# Altium schematic sheet 03-GPS.SchDoc
size A4
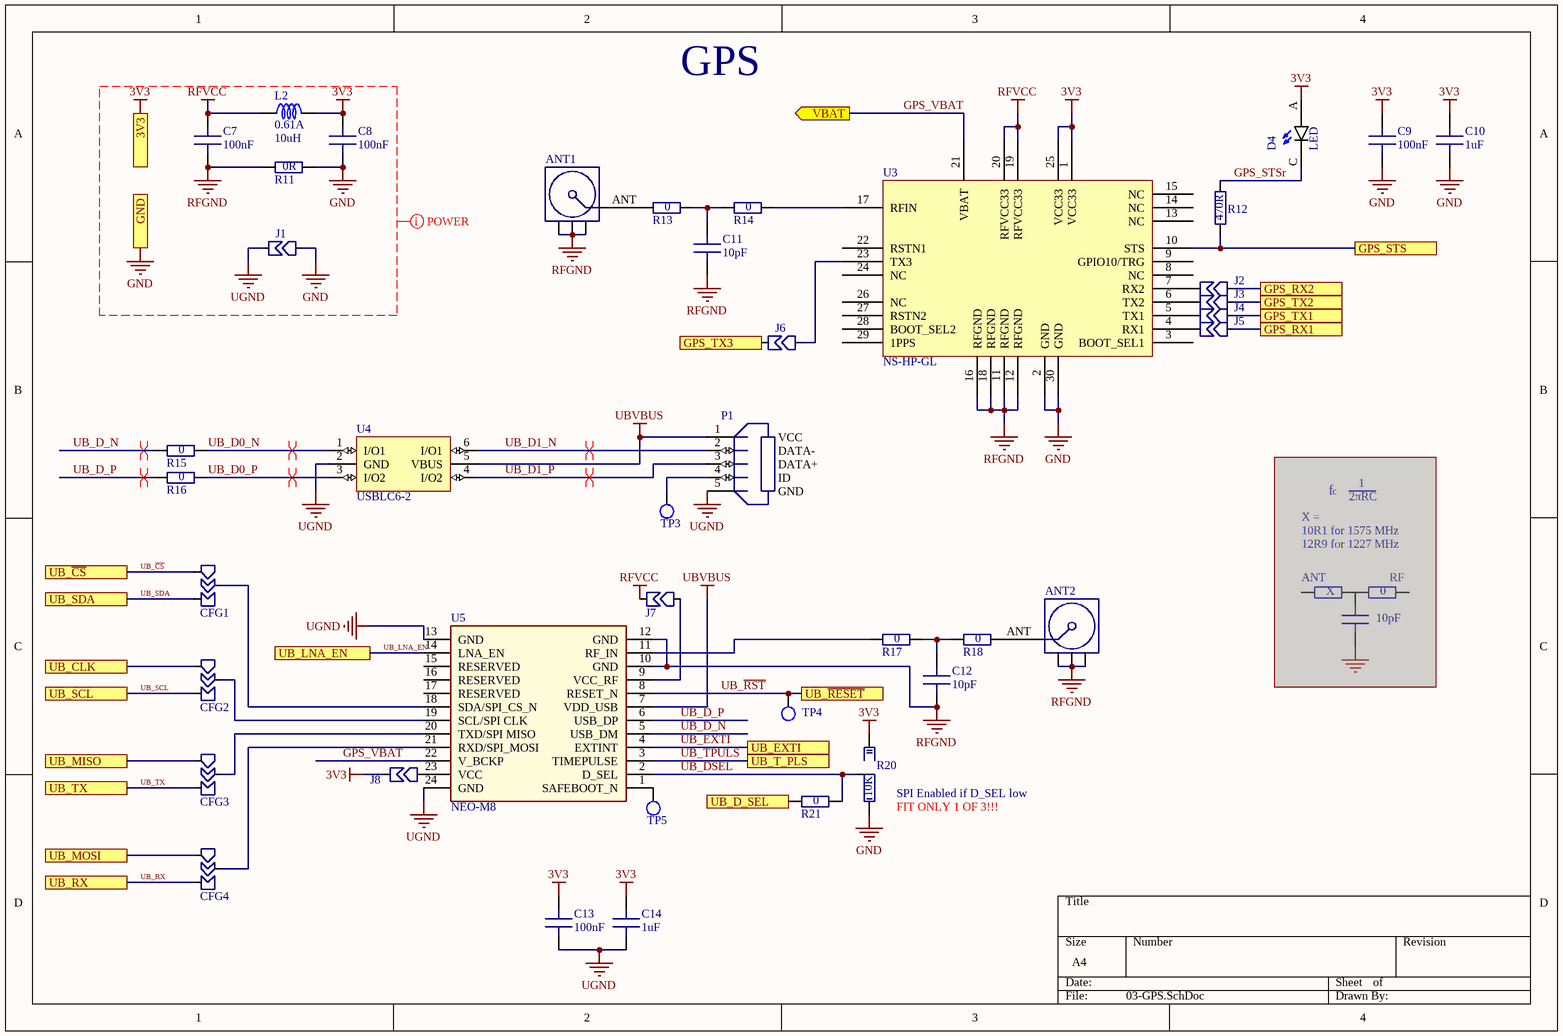
[diagram p0: 03-GPS.SchDoc]

## Parts
(Parts that share a designator on the sheet are numbered #1, #2 ... from top to bottom, then left to right.)
ANT1  UFL  [U.FL CONNECTOR]  (value not drawn)
ANT2  UFL  [U.FL CONNECTOR]  (value not drawn)
C7  100nF  [C0603_NOSILK]
C8  100nF  [C0603_NOSILK]
C9  100nF  [C0603]
C10  1uF  [C0805]
C11  10pF  [C0402]
C12  10pF  [C0402]
C13  100nF  [C0603]
C14  1uF  [C0805]
C_F  10pF  [C0402]  (masked out: inside a compile mask, not in the netlist)
CFG1  CFG3_ORTH  [CFG_0603]  (value not drawn)
CFG2  CFG3_ORTH  [CFG_0603]  (value not drawn)
CFG3  CFG3_ORTH  [CFG_0603]  (value not drawn)
CFG4  CFG3_ORTH  [CFG_0603]  (value not drawn)
D4  LED  [LED_0604]
J1  CFG2  [CFG_J_0603]  (value not drawn)
J2  CFG2  [CFG_J_0603]  (value not drawn)
J3  CFG2  [CFG_J_0603]  (value not drawn)
J4  CFG2  [CFG_J_0603]  (value not drawn)
J5  CFG2  [CFG_J_0603]  (value not drawn)
J6  CFG2  [CFG_J_0603]  (value not drawn)
J7  CFG2  [CFG_J_0603]  (value not drawn)
J8  CFG2  [CFG_J_0603]  (value not drawn)
L2  Current: 0.61A  Inductivity: 10uH  [L_CDRH4D18]  (hidden comment: *)
P1  440247-2  [CON-UUSB-F-2]  (value not drawn)
R11  Resistance: 0R  [R0805]
R12  Resistance: 470R  [R0603]
R13  Resistance: 0  [R0402]
R14  Resistance: 0  [R0402]
R15  Resistance: 0  [R0402]
R16  Resistance: 0  [R0402]
R17  Resistance: 0  [R0402]
R18  Resistance: 0  [R0402]
R20  Resistance: 10K  [RJ0603]
R21  Resistance: 0  [R0603]
R?#1  Resistance: X  [R0402]  (masked out: inside a compile mask, not in the netlist)
R?#2  Resistance: 0  [R0402]  (masked out: inside a compile mask, not in the netlist)
TP3  TEST_POINT  [TP_1mm]  (value not drawn)
TP4  TEST_POINT  [TP_1mm]  (value not drawn)
TP5  TEST_POINT  [TP_1mm]  (value not drawn)
U3  NS-HP-GL  [SKYTRAQ-MOD-COMB]
U4  USBLC6-2  [SOT-666]
U5  NEO-M8  [NEO]

## Ports
3V3 (out), GND, GPS_RX1, GPS_RX2, GPS_STS, GPS_TX1, GPS_TX2, GPS_TX3, UB_CLK, UB_D_SEL, UB_EXTI, UB_LNA_EN, UB_MISO, UB_MOSI, UB_RX, UB_SCL, UB_SDA, UB_T_PLS, UB_TX, UB_~{CS}, UB_~{RESET}, VBAT (out)

## Nets
3V3: C8.2 C9.2 C10.2 C13.2 C14.2 D4.A J8.1(A) L2.2 R20.3 U3.1(VCC33) U3.25(VCC33) ; port 3V3
GND: C8.1 C9.1 C10.1 J1.2(IN) R11.2 R20.1 U3.2(GND) U3.30(GND) ; port GND
RFGND: ANT1.GND ANT2.GND C7.1 C11.1 C12.1 R11.1 U3.11(RFGND) U3.12(RFGND) U3.16(RFGND) U3.18(RFGND) U5.10(GND) U5.12(GND)
RFVCC: C7.2 J7.1(A) L2.1 U3.19(RFVCC33) U3.20(RFVCC33)
UBVBUS: P1.1(VCC) U4.5(VBUS) U5.7(VDD_USB)
UGND: C13.1 C14.1 J1.1(A) P1.5(GND) U4.2(GND) U5.13(GND) U5.24(GND)
GPS_RX1: J5.2(IN) ; port GPS_RX1
GPS_RX2: J2.2(IN) ; port GPS_RX2
GPS_STS: R12.1 U3.10(STS) ; port GPS_STS
GPS_STSr: D4.C R12.2
GPS_TX1: J4.2(IN) ; port GPS_TX1
GPS_TX2: J3.2(IN) ; port GPS_TX2
GPS_TX3: J6.1(A) ; port GPS_TX3
GPS_VBAT: U3.21(VBAT) U5.22(V_BCKP) ; port VBAT
UB_~{CS}: CFG1.3(B) ; port UB_~{CS}
UB_CLK: CFG2.3(B) ; port UB_CLK
UB_D0_N: R15.2 U4.1(I/O1)
UB_D0_P: R16.2 U4.3(I/O2)
UB_D1_N: P1.2(DATA-) U4.6(I/O1)
UB_D1_P: P1.3(DATA+) U4.4(I/O2)
UB_D_N: R15.1 U5.5(USB_DM)
UB_D_P: R16.1 U5.6(USB_DP)
UB_D_SEL: R21.1 ; port UB_D_SEL
UB_DSEL: R20.2 R21.2 U5.2(D_SEL)
UB_EXTI: U5.4(EXTINT) ; port UB_EXTI
UB_LNA_EN: U5.14(LNA_EN) ; port UB_LNA_EN
UB_MISO: CFG3.3(B) ; port UB_MISO
UB_MOSI: CFG4.3(B) ; port UB_MOSI
UB_~{RST}: TP4.1 U5.8(RESET_N) ; port UB_~{RESET}
UB_RX: CFG4.1(A) ; port UB_RX
UB_SCL: CFG2.1(A) ; port UB_SCL
UB_SDA: CFG1.1(A) ; port UB_SDA
UB_TPULS: U5.3(TIMEPULSE) ; port UB_T_PLS
UB_TX: CFG3.1(A) ; port UB_TX
NetANT1_ANT: ANT1.ANT(SIGNAL) R13.1
NetANT2_ANT: ANT2.ANT(SIGNAL) R18.2
NetC11_2: C11.2 R13.2 R14.1
NetC12_2: C12.2 R17.2 R18.1
NetCFG1_2: CFG1.2(IN) U5.18(SDA/SPI_CS_N)
NetCFG2_2: CFG2.2(IN) U5.19(SCL/SPI_CLK)
NetCFG3_2: CFG3.2(IN) U5.20(TXD/SPI_MISO)
NetCFG4_2: CFG4.2(IN) U5.21(RXD/SPI_MOSI)
NetJ2_1: J2.1(A) U3.7(RX2)
NetJ3_1: J3.1(A) U3.6(TX2)
NetJ4_1: J4.1(A) U3.5(TX1)
NetJ5_1: J5.1(A) U3.4(RX1)
NetJ6_2: J6.2(IN) U3.23(TX3)
NetJ7_2: J7.2(IN) U5.9(VCC_RF)
NetJ8_2: J8.2(IN) U5.23(VCC)
NetP1_4: P1.4(ID) TP3.1
NetR14_2: R14.2 U3.17(RFIN)
NetR17_1: R17.1 U5.11(RF_IN)
NetTP5_1: TP5.1 U5.1(SAFEBOOT_N)

Not connected (* = marked no-connect by the designer): U3 3(BOOT_SEL1) 8(NC) 9(GPIO10/TRG) 13(NC) 14(NC) 15(NC) 22(RSTN1) 24(NC) 26(NC) 27(RSTN2) 28(BOOT_SEL2) 29(1PPS); U5 15(RESERVED) 16(RESERVED) 17(RESERVED)

## Layout directives
differential pair; net class USB: UB_D0_N, UB_D0_P, UB_D1_N, UB_D1_P, UB_D_N, UB_D_P
net class POWER_NET_CLASS: 3V3, GND, RFGND, RFVCC, UGND

## Notes on the sheet
- GPS
- X =
- f
- c
- 2πRC
- 1
- 10R1 for 1575 MHz
- (near R?#2) 12R9 for 1227 MHz
- (near R?#1) ANT
- (near R?#2) RF
- (near R20) FIT ONLY 1 OF 3!!!
- (near R20) SPI Enabled if D_SEL low

## Library data of the parts
ANT1 ANT2 = ANT-U.FL: Generic U.FL connector with 1 ANT + 3 GND
C7-C9 C13 = C0603_100nF_16V: Ceramic capacitor; Voltage: 16V; Capacity: 100nF; Size: 0603; Value: 100nF
C10 C14 = C0805_1uF_25V: Ceramic capacitor; Voltage: 25V; Capacity: 1uF; Size: 0805; Value: 1uF
C11 C12 C_F = C0402_10pF_50V: Ceramic capacitor; Voltage: 50V; Capacity: 10pF; Size: 0402; Value: 10pF
D4 = LED: Led General; MF: Dialight; MP: 598-8140-107F; SnapEDA_Link: https://www.snapeda.com/parts/598-8140-107F/Dialight/view-part/?ref=snap; Price: None; Availability: Unavailable; Package: 0805 Dialight; Value: *
L2 = L_CDRH4D18_10uH_0.61A: Inductor Generic; Value: *; Size: CDRH4D18; Url: http://www.kosmodrom.com.ua/el.php?name=CDRH4D18NP-100NC
P1 = CON-USB-Micro/Mini: Mini/Micro USB B Type RCPT; MF: TE Connectivity; Availability: Unavailable; Package: None; MP: 440247-2; SnapEDA_Link: https://www.snapeda.com/parts/440247-2/TE%20Connectivity%20AMP%20Connectors/view-part/?ref=snap; TE_purchase_URL: https://www.te.com/usa-en/product-440247-2.html?te_bu=Cor&te_type=disp&te_campaign=seda_glo_cor-seda-global-disp-prtnr-fy19-seda-model-bom-cta_sma-317_1&elqCampaignId=32493; Price: None; Value: *
R11 = R0805_0R: Resistor General; Tolerance: *; Size: 0805
R12 = R0603_470R: Resistor General; Tolerance: 5%; Size: 0603
R13-R18 R?#1 R?#2 = R0402_0R: Resistor General; Tolerance: *; Size: 0402
R20 = RJ0603_10K: Resistor General; Tolerance: 5%; Size: 0603
R21 = R0603_0R: Resistor General; Tolerance: *; Size: 0603
U3 = NS-HP-GL: NS-HP-GL / S2525F8-GL-RTK in SMD
U4 = USBLC6-2: Very low capacitance ESD protection
U5 = NEO: u-blox NEO GNSS module; Part Description: u-blox GNSS module; Manufacturer: u-blox; Value: NEO-M8